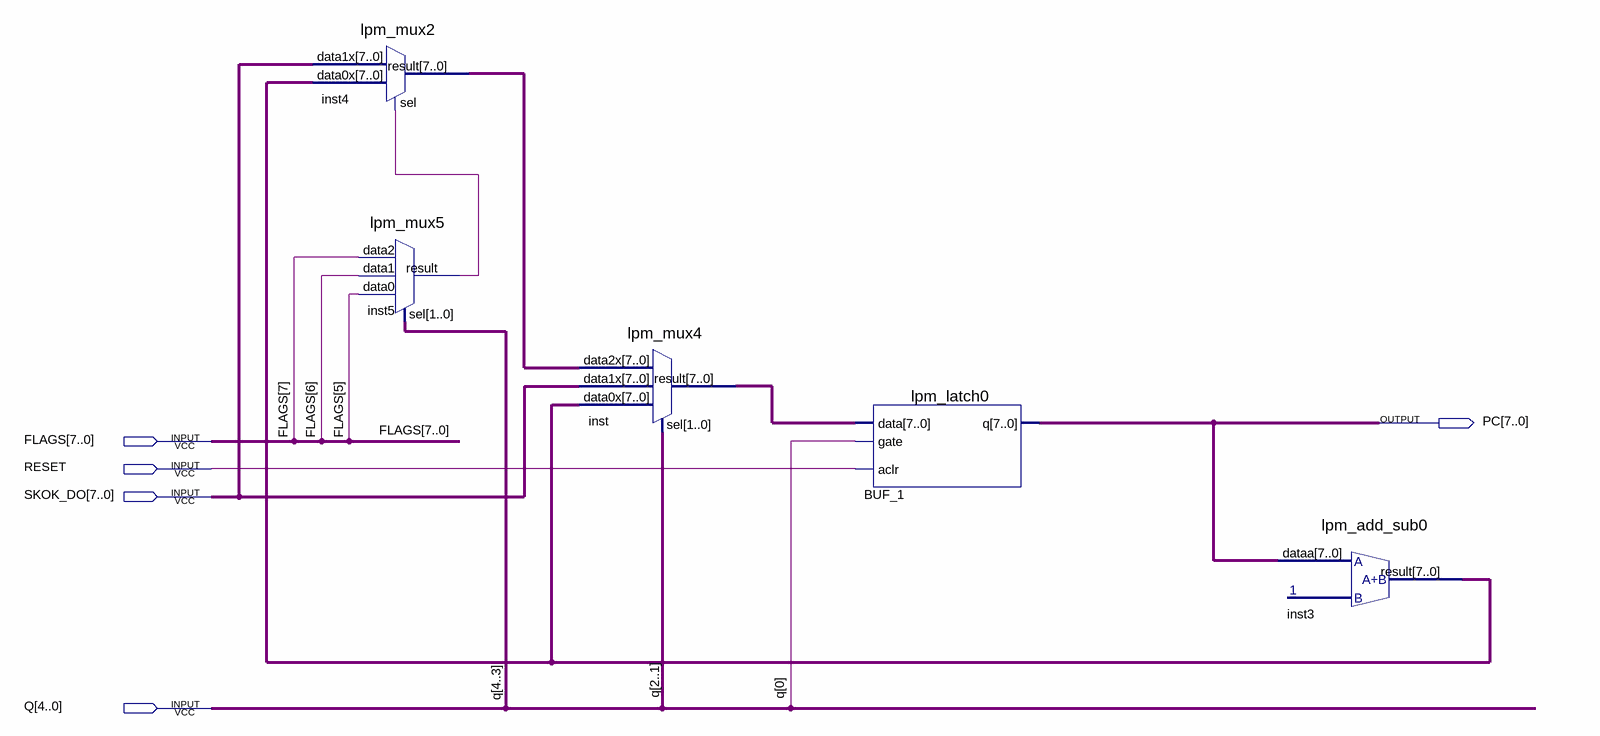
[diagram p0: schematic sheet]
// Quartus schematic PC.bdf as structural Verilog: 5 symbols, 5 pins
module PC (
  input  [7:0] FLAGS,
  input  RESET,
  input  [7:0] SKOK_DO,
  input  [4:0] Q,
  output [7:0] PC
);

  wire inst5_result;
  wire [7:0] inst3_result, inst4_result, inst_result;

  lpm_mux2 inst4 (.data1x(SKOK_DO), .data0x(inst3_result), .sel(inst5_result), .result(inst4_result));
  lpm_mux5 inst5 (.data2(FLAGS[7]), .data1(FLAGS[6]), .data0(FLAGS[5]), .sel(Q[4:3]), .result(inst5_result));
  lpm_mux4 inst (.data2x(inst4_result), .data1x(SKOK_DO), .data0x(inst3_result), .sel(Q[2:1]), .result(inst_result));
  lpm_latch0 BUF_1 (.data(inst_result), .gate(Q[0]), .aclr(RESET), .q(PC));
  lpm_add_sub0 inst3 (.dataa(PC), .result(inst3_result));
endmodule
